# Altium schematic sheet Final.SchDoc
size B; SheetNumber: 1; SheetTotal: 1; SPICEModelCacheLTGNFPKH: <root> / <DocumentId>LTGNFPKH</DocumentId> / <CacheFrame Number="0"> / <Model Name="led1" Kind="MDL"> / <Text>*Typ RED GaAs LED: Vf=1.7V Vr=4V If=40mA trr=3uS / *LED Pinout: 1=A, 2=K / .MODEL LED1 D (IS=93.2P RS=42M N=3.73 BV=4 IBV=10U / + CJO=2.97P VJ=.75 M=.333 TT=4.32U)</Text> / </Model> / </CacheFrame> / </root>
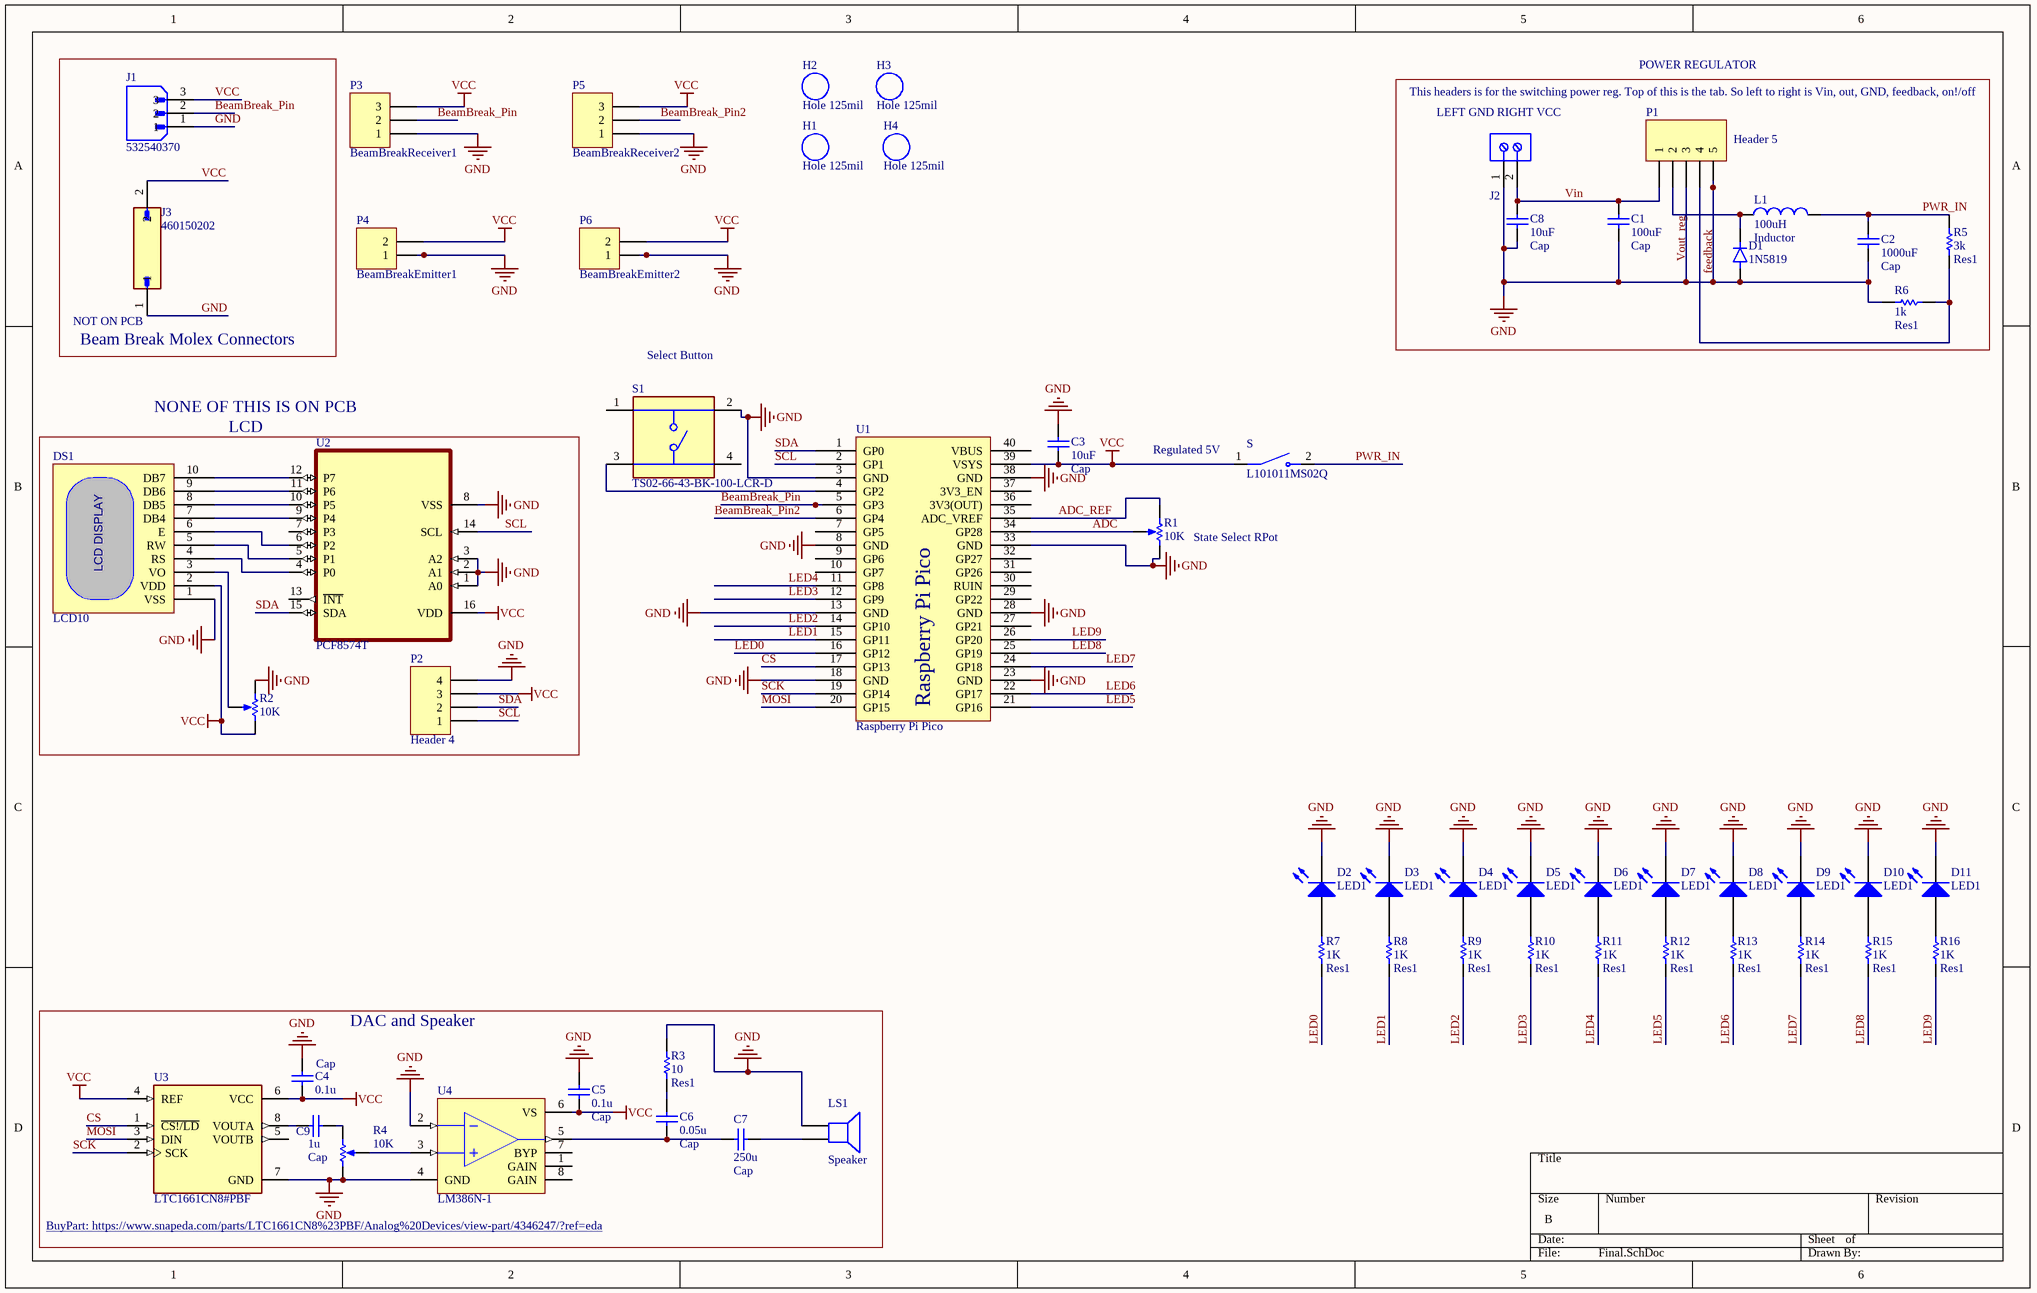
[diagram p0: Final.SchDoc]

## Parts
C1  Cap  value 100uF  [RAD-0.3]
C2  Cap  value 1000uF  [RAD-0.3]
C3  Cap  value 10uF  [RAD-0.3]
C4  Cap  value 0.1u  [RAD-0.3]
C5  Cap  value 0.1u  [RAD-0.3]
C6  Cap  value 0.05u  [RAD-0.3]
C7  Cap  value 250u  [RAD-0.3]
C8  Cap  value 10uF  [RAD-0.3]
C9  Cap  value 1u  [RAD-0.3]
D1  1N5819  [DIOAD1036W78L470D235]
D2  LED1  [LED-1]
D3  LED1  [LED-1]
D4  LED1  [LED-1]
D5  LED1  [LED-1]
D6  LED1  [LED-1]
D7  LED1  [LED-1]
D8  LED1  [LED-1]
D9  LED1  [LED-1]
D10  LED1  [LED-1]
D11  LED1  [LED-1]
DS1  LCD10  [HDR1X10]
H1  Hole 125mil  [Hole 125mil]
H2  Hole 125mil  [Hole 125mil]
H3  Hole 125mil  [Hole 125mil]
H4  Hole 125mil  [Hole 125mil]
J1  532540370  [MOLEX_532540370]
J2  691137710002  [691137710002]  (value not drawn)
J3  460150202  [MOLEX_460150202]
L1  Inductor  value 100uH  [0402-A]
LS1  Speaker  [PIN2]
P1  Header 5  [HDR1X5]
P2  Header 4  [HDR1X4]
P3  BeamBreakReceiver1  [HDR1X3]
P4  BeamBreakEmitter1  [HDR1X2H]
P5  BeamBreakReceiver2  [HDR1X3]
P6  BeamBreakEmitter2  [HDR1X2H]
R1  value 10K  [POT inline wide]  (hidden comment: RPot_1)
R2  value 10K  [POT OFFSET 200]  (hidden comment: RPot_3)
R3  Res1  value 10  [AXIAL-0.3]
R4  value 10K  [POT inline wide]  (hidden comment: RPot_1)
R5  Res1  value 3k  [AXIAL-0.3]
R6  Res1  value 1k  [AXIAL-0.3]
R7  Res1  value 1K  [AXIAL-0.3]
R8  Res1  value 1K  [AXIAL-0.3]
R9  Res1  value 1K  [AXIAL-0.3]
R10  Res1  value 1K  [AXIAL-0.3]
R11  Res1  value 1K  [AXIAL-0.3]
R12  Res1  value 1K  [AXIAL-0.3]
R13  Res1  value 1K  [AXIAL-0.3]
R14  Res1  value 1K  [AXIAL-0.3]
R15  Res1  value 1K  [AXIAL-0.3]
R16  Res1  value 1K  [AXIAL-0.3]
S  L101011MS02Q  [SW_L101011MS02Q]
S1  TS02-66-43-BK-100-LCR-D  [SW_TS02-66-43-BK-100-LCR-D]
U1  Raspberry Pi Pico  [Raspberry Pi Pico]
U2  PCF8574T  [SOIC127P1032X265-16N]
U3  LTC1661CN8#PBF  [DIP794W45P254L1016H393Q8]
U4  LM386N-1  [DIP-8]

## Blocks framed on the sheet
Beam Break Molex Connectors: J1 J3
LCD: DS1 P2 R2 U2
DAC and Speaker: C4-C7 C9 LS1 R3 R4 U3 U4

## Nets
GND: C1.2 C2.1 C3.1 C4.2 C5.2 C8.1 D1.A D2.2(K) D3.2(K) D4.2(K) D5.2(K) D6.2(K) D7.2(K) D8.2(K) D9.2(K) D10.2(K) D11.2(K) DS1.1(VSS) J1.1 J2.1 J3.1 LS1.1 P1.3 P1.5 P2.4 P3.1 P4.1 P5.1 P6.1 R1.3(BOT) R2.1(TOP) R3.2 R4.1(TOP) R6.1 S1.2 U1.3(GND) U1.8(GND) U1.13(GND) U1.18(GND) U1.23(GND) U1.28(GND) U1.33(GND) U1.38(GND) U2.1(A0) U2.2(A1) U2.3(A2) U2.8(VSS) U3.7(GND) U4.2(IN-) U4.4(GND)
VCC: C3.2 C4.1 C5.1 DS1.2(VDD) J1.3 J3.2 P2.3 P3.3 P4.2 P5.3 P6.2 R2.3(BOT) S.1 U1.39(VSYS) U2.16(VDD) U3.4(REF) U3.6(VCC) U4.6(VS)
ADC: R1.2(TAP) U1.34(GP28)
ADC_REF: R1.1(TOP) U1.35(ADC_VREF)
BeamBreak_Pin: J1.2 P3.2 U1.5(GP3)
BeamBreak_Pin2: P5.2 U1.6(GP4)
CS: U1.17(GP13) U3.1(~{CS!/LD})
feedback: P1.4 R5.1 R6.2
LED0: R7.1 U1.16(GP12)
LED1: R8.1 U1.15(GP11)
LED2: R9.1 U1.14(GP10)
LED3: R10.1 U1.12(GP9)
LED4: R11.1 U1.11(GP8)
LED5: R12.1 U1.21(GP16)
LED6: R13.1 U1.22(GP17)
LED7: R14.1 U1.24(GP18)
LED8: R15.1 U1.25(GP19)
LED9: R16.1 U1.26(GP20)
MOSI: U1.20(GP15) U3.3(DIN)
PWR_IN: C2.2 L1.2 R5.2 S.2
SCK: U1.19(GP14) U3.2(SCK)
SCL: P2.1 U1.2(GP1) U2.14(SCL)
SDA: P2.2 U1.1(GP0) U2.15(SDA)
Vin: C1.1 C8.2 J2.2 P1.1
Vout_reg: D1.C(K) L1.1 P1.2
NetC6_1: C6.1 C7.1 U4.5(OUT)
NetC6_2: C6.2 R3.1
NetC7_2: C7.2 LS1.2
NetC9_1: C9.1 R4.3(BOT)
NetC9_2: C9.2 U3.8(VOUTA)
NetD2_1: D2.1(A) R7.2
NetD3_1: D3.1(A) R8.2
NetD4_1: D4.1(A) R9.2
NetD5_1: D5.1(A) R10.2
NetD6_1: D6.1(A) R11.2
NetD7_1: D7.1(A) R12.2
NetD8_1: D8.1(A) R13.2
NetD9_1: D9.1(A) R14.2
NetD10_1: D10.1(A) R15.2
NetD11_1: D11.1(A) R16.2
NetDS1_3: DS1.3(VO) R2.2(TAP)
NetDS1_4: DS1.4(RS) U2.4(P0)
NetDS1_5: DS1.5(RW) U2.5(P1)
NetDS1_6: DS1.6(E) U2.6(P2)
NetDS1_7: DS1.7(DB4) U2.9(P4)
NetDS1_8: DS1.8(DB5) U2.10(P5)
NetDS1_9: DS1.9(DB6) U2.11(P6)
NetDS1_10: DS1.10(DB7) U2.12(P7)
NetR4_2: R4.2(TAP) U4.3(IN+)
NetS1_3: S1.3 U1.4(GP2)

Not connected (* = marked no-connect by the designer): S1 1 4; U1 7(GP5) 9(GP6) 10(GP7) 27(GP21) 29(GP22) 30(RUIN) 31(GP26) 32(GP27) 36(3V3(OUT)) 37(3V3_EN) 40(VBUS); U2 7(P3) 13(~{INT}); U3 5(VOUTB); U4 1(GAIN) 7(BYP) 8(GAIN)

## Notes on the sheet
- This headers is for the switching power reg. Top of this is the tab. So left to right is Vin, out, GND, feedback, on!/off
- POWER REGULATOR
- (near J2) LEFT GND RIGHT VCC
- (near J3) NOT ON PCB
- (near S1) Select Button
- NONE OF THIS IS ON PCB
- (near S) Regulated 5V
- (near R1) State Select RPot
- (in symbol LCD10) LCD DISPLAY

## Library data of the parts
C1-C9 = Cap: Capacitor; Published: 8-Jun-2000; LatestRevisionDate: 17-Jul-2002; LatestRevisionNote: Re-released for DXP Platform.; PackageReference: RAD-0.3; Publisher: Altium Limited; PackageDescription: Radial Cap, Thru-Hole; 2 Leads; 0.3 in Pin Spacing
D1 = 1N5819: 1A, 40V, Planar Schottky; MF: Taiwan Semiconductor; SnapEDA_Link: https://www.snapeda.com/parts/1N5819/taiwan/view-part/?ref=snap; Package: DO-41-2 Taiwan Semiconductor; Value: *; MP: 1N5819; Check_prices: https://www.snapeda.com/parts/1N5819/taiwan/view-part/?ref=eda
D2-D11 = LED1: Typical RED GaAs LED; Published: 8-Jun-2000; LatestRevisionDate: 08-Jul-2005; LatestRevisionNote: Mech Layer 1 removed.; PackageReference: LED-1; Publisher: Altium Limited; PackageDescription: LED; 2 Leads
J1 = 532540370: 2.00mm Pitch, Micro-Latch PCB Header, Single Row, Right-Angle, Through Hole, Tin (Sn) Plating, 3 Circuits, Tray, 3.50mm PC Tail Length; MP: 532540370; Package: None; Price: None; Availability: Unavailable; Value: *
J2 = 691137710002: WR-TBL Series 1377 Horizontal Entry, THT, pitch 5mm, 2p; Manufacturer: Wurth Elektronik; Modularity: No; Rated Current: 16A; Working Voltage: 300V; ComponentLink1Description: Website Link; ComponentLink1URL: https://www.we-online.com/redexpert/article/691137710002?ad; ComponentLink2Description: Datasheet Link; ComponentLink2URL: https://www.we-online.com/redexpert/spec/691137710002?ad; Manufacturer Part Number: 691137710002; Category: Terminal Blocks; Match Code: WR-TBL; Mount: Through Hole; Operating Temperature Max: 120°C; Operating Temperature Min: -30°C; Packaging: Box; Application: Pressure Clamp; Number of Pins: 2; Number of Rows: 1; Orientation: Horizontal; Pitch: 5mm
J3 = 460150202: Conn Power HDR 2 POS 4.2mm Solder ST Thru-Hole 2 Terminal 1 Port Mini-Fit Jr Bag; Package: None; MP: 460150202; Price: None; Availability: Unavailable; Value: *
L1 = Inductor: Code_IEC: 1005; Published: 8-Jun-2000; LatestRevisionDate: 29-May-2009; LatestRevisionNote: IPC-7351 Footprint Added.; PackageReference: 0402-A; Publisher: Altium Limited; PackageDescription: Chip Inductor; Code_JEITA: 0402
LS1 = Speaker: Loudspeaker; Published: 24-Mar-1999; LatestRevisionDate: 17-Jul-2002; LatestRevisionNote: Re-released for DXP Platform.; PackageReference: PIN2; Publisher: Altium Limited
P1 = Header 5: Header, 5-Pin; LatestRevisionDate: 17-Jul-2002; LatestRevisionNote: Re-released for DXP Platform.; Publisher: Altium Limited
P2 = Header 4: Header, 4-Pin; LatestRevisionDate: 17-Jul-2002; LatestRevisionNote: Re-released for DXP Platform.; Publisher: Altium Limited
P3 P5 = Header 3: Header, 3-Pin; LatestRevisionDate: 17-Jul-2002; LatestRevisionNote: Re-released for DXP Platform.; Publisher: Altium Limited
P4 P6 = Header 2H: Header, 2-Pin, Right Angle; LatestRevisionDate: 17-Jul-2002; LatestRevisionNote: Re-released for DXP Platform.; Publisher: Altium Limited
R1 R4 = RPot_3: Potentiometer; Sim Note: Enter the Resistance value and the set point into parameter fields.; Set Position: 0.5; Published: 8-Jun-2000; LatestRevisionDate: 17-Jul-2002; LatestRevisionNote: Re-released for DXP Platform.; PackageReference: VR5; Publisher: Altium Limited; PackageDescription: Variable Resistor, Thru-Hole; 3 Leads
R2 = RPot: Potentiometer; Sim Note: Enter the Resistance value and the set point into parameter fields.; Set Position: 0.5; Published: 8-Jun-2000; LatestRevisionDate: 17-Jul-2002; LatestRevisionNote: Re-released for DXP Platform.; Publisher: Altium Limited
R3 R5-R16 = Res1: Resistor; Published: 8-Jun-2000; LatestRevisionDate: 17-Jul-2002; LatestRevisionNote: Re-released for DXP Platform.; PackageReference: AXIAL-0.3; Publisher: Altium Limited; PackageDescription: Axial Device, Thru-Hole; 2 Leads; 0.3 in Pin Spacing
S = L101011MS02Q: Slide Switch SPST Through Hole; MF: C&K; MP: L101011MS02Q; Value: *; Availability: Unavailable; SnapEDA_Link: https://www.snapeda.com/parts/L101011MS02Q/C%26K/view-part/455586/?ref=snap; Price: None; Package: None
S1 = TS02-66-43-BK-100-LCR-D: 6 x 6 mm, 4.3 mm Actuator Height, 100 gf, Black, Long Crimped, Through Hole, SPST, Tactile Switch; MF: Same Sky; SnapEDA_Link: https://www.snapeda.com/parts/TS02-66-43-BK-100-LCR-D/Same+Sky/view-part/?ref=snap; Package: None; Value: *; MP: TS02-66-43-BK-100-LCR-D; Check_prices: https://www.snapeda.com/parts/TS02-66-43-BK-100-LCR-D/Same+Sky/view-part/?ref=eda
U2 = PCF8574T: I/O Expander 8 IÂ²C 100 kHz 20-SSOP; MF: NXP Semiconductors; MP: PCF8574T; Price: None; Availability: In Stock; Package: SOIC-16 NXP Semiconductors; Purchase-URL: https://pricing.snapeda.com/search/part/PCF8574T/?ref=eda; SnapEDA_Link: https://www.snapeda.com/parts/PCF8574T/NXP+Semiconductors/view-part/?ref=snap; Value: *; Check_prices: https://www.snapeda.com/parts/PCF8574T/NXP+Semiconductors/view-part/?ref=eda
U3 = LTC1661CN8#PBF: 10 Bit Digital to Analog Converter 2 8-PDIP; MF: Analog Devices; MP: LTC1661CN8#PBF; Package: PDIP -8 Analog Devices; Availability: Warning; Price: None; SnapEDA_Link: https://www.snapeda.com/parts/LTC1661CN8%23PBF/Analog%20Devices/view-part/4346247/?ref=snap; Value: *; Mouser-Purchase-URL: https://snapeda.com/shop?store=Mouser&id=4346247; DigiKey-Purchase-URL: https://snapeda.com/shop?store=DigiKey&id=4346247; BuyPart: https://www.snapeda.com/parts/LTC1661CN8%23PBF/Analog%20Devices/view-part/4346247/?ref=eda
U4 = LM386N-1: Low-Voltage Audio Power Amplifier; Published: 15-Apr-2002; DatasheetDocument: Sep-1997; PackageDocument: Sep-1997; PackageReference: N08E; Publisher: Altium Limited